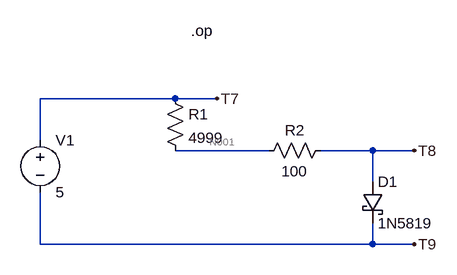
[diagram p0: schematic Draft3.asc]
Draft3.asc, the LTspice schematic file:
Version 4.1
SHEET 1 880 680
WIRE 288 48 80 48
WIRE 352 48 288 48
WIRE 80 112 80 48
WIRE 432 128 288 128
WIRE 592 128 512 128
WIRE 656 128 592 128
WIRE 592 176 592 128
WIRE 80 272 80 192
WIRE 592 272 592 240
WIRE 592 272 80 272
WIRE 656 272 592 272
FLAG 352 48 T7
FLAG 656 128 T8
FLAG 656 272 T9
SYMBOL voltage 80 96 R0
SYMATTR InstName V1
SYMATTR Value 5
SYMBOL res 272 32 R0
SYMATTR InstName R1
SYMATTR Value 4999
SYMBOL res 528 112 R90
WINDOW 0 0 56 VBottom 2
WINDOW 3 32 56 VTop 2
SYMATTR InstName R2
SYMATTR Value 100
SYMBOL schottky 576 176 R0
SYMATTR InstName D1
SYMATTR Value 1N5819
TEXT 312 -56 Left 2 !.op

The netlist it stands for:
* Draft3.asc
V1 T7 T9 5
R1 T7 N001 4999
R2 T8 N001 100
D1 T8 T9 1N5819
.model D D
.lib standard.dio
.op
.backanno
.end

* Results of the author's LTspice run, read from the files saved beside the schematic
* Operating Point:
*   V(t9) = -122.2 mV
*   V(t8) = 8.361 µV
*   V(t7) = 4.878 V
*   V(n001) = 95.67 mV
*   I(V1) = -956.6 µA
*   I(R2) = -956.6 µA
*   I(R1) = 956.6 µA
*   I(D1) = 956.6 µA